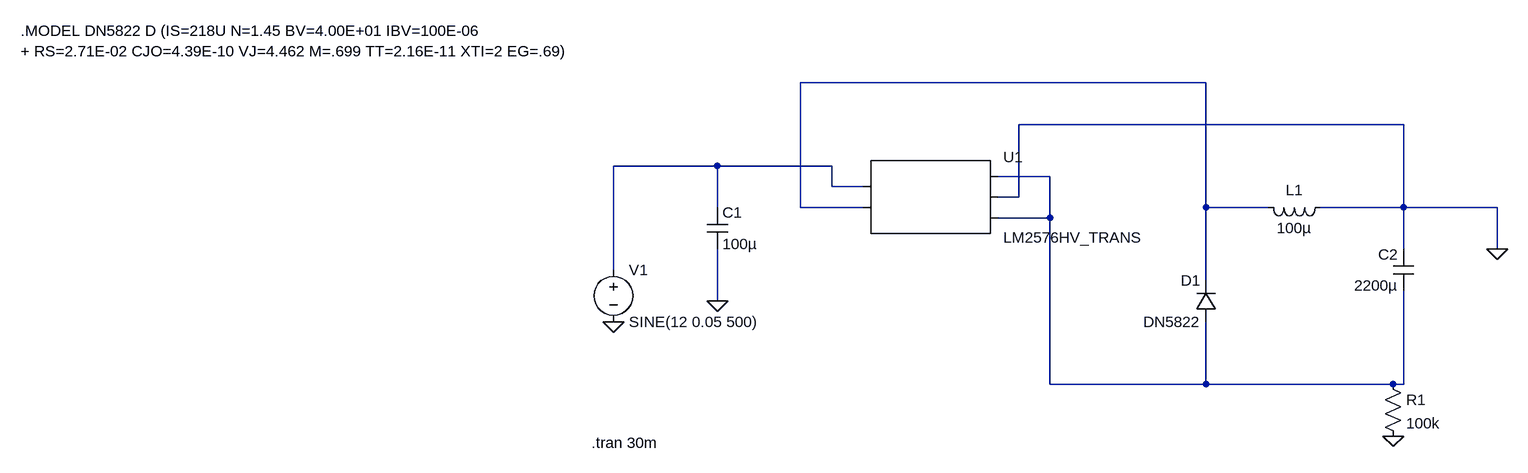
[diagram p0: schematic regulador(-12v)LM2576HV.asc]
regulador(-12v)LM2576HV.asc, the LTspice schematic file:
Version 4
SHEET 1 880 680
WIRE 352 -144 -272 -144
WIRE 656 -80 64 -80
WIRE -400 -16 -560 -16
WIRE -224 -16 -400 -16
WIRE 112 0 32 0
WIRE -224 16 -224 -16
WIRE -176 16 -224 16
WIRE 64 32 64 -80
WIRE 64 32 32 32
WIRE -400 48 -400 -16
WIRE -272 48 -272 -144
WIRE -176 48 -272 48
WIRE 352 48 352 -144
WIRE 448 48 352 48
WIRE 656 48 656 -80
WIRE 656 48 528 48
WIRE 800 48 656 48
WIRE 112 64 112 0
WIRE 112 64 32 64
WIRE 656 112 656 48
WIRE 800 112 800 48
WIRE -560 144 -560 -16
WIRE 352 160 352 48
WIRE -400 192 -400 112
WIRE 112 320 112 64
WIRE 352 320 352 224
WIRE 352 320 112 320
WIRE 640 320 352 320
WIRE 656 320 656 176
WIRE 656 320 640 320
FLAG -560 224 0
FLAG -400 192 0
FLAG 800 112 0
FLAG 640 400 0
SYMBOL voltage -560 128 R0
WINDOW 123 0 0 Left 0
WINDOW 39 0 0 Left 0
SYMATTR InstName V1
SYMATTR Value SINE(12 0.05 500)
SYMBOL AutoGenerated\\LM2576HV_TRANS -80 32 R0
SYMATTR InstName U1
SYMBOL cap -416 48 R0
SYMATTR InstName C1
SYMATTR Value 100µ
SYMBOL ind 544 32 R90
WINDOW 0 5 56 VBottom 2
WINDOW 3 32 56 VTop 2
SYMATTR InstName L1
SYMATTR Value 100µ
SYMBOL cap 672 176 R180
WINDOW 0 24 56 Left 2
WINDOW 3 24 8 Left 2
SYMATTR InstName C2
SYMATTR Value 2200µ
SYMBOL diode 368 224 R180
WINDOW 0 24 64 Left 2
WINDOW 3 24 0 Left 2
SYMATTR InstName D1
SYMATTR Value DN5822
SYMBOL res 624 304 R0
SYMATTR InstName R1
SYMATTR Value 100k
TEXT -594 410 Left 2 !.tran 30m
TEXT -1472 -224 Left 2 !.MODEL DN5822 D (IS=218U N=1.45 BV=4.00E+01 IBV=100E-06\n+ RS=2.71E-02 CJO=4.39E-10 VJ=4.462 M=.699 TT=2.16E-11 XTI=2 EG=.69)

The netlist it stands for:
* regulador(-12v)LM2576HV.asc
V1 N002 0 SINE(12 0.05 500)
* U1: LM2576HV_TRANS (symbol AutoGenerated\LM2576HV_TRANS not available, pins judged from their places): pin1=N002 pin2=N001 pin3=N003 pin4=0 pin5=N003
C1 N002 0 100µ
L1 0 N001 100µ
C2 N003 0 2200µ
D1 N003 N001 DN5822
R1 N003 0 100k
.model D D
.lib standard.dio
.tran 30m
.MODEL DN5822 D (IS=218U N=1.45 BV=4.00E+01 IBV=100E-06
+ RS=2.71E-02 CJO=4.39E-10 VJ=4.462 M=.699 TT=2.16E-11 XTI=2 EG=.69)
.backanno
.end